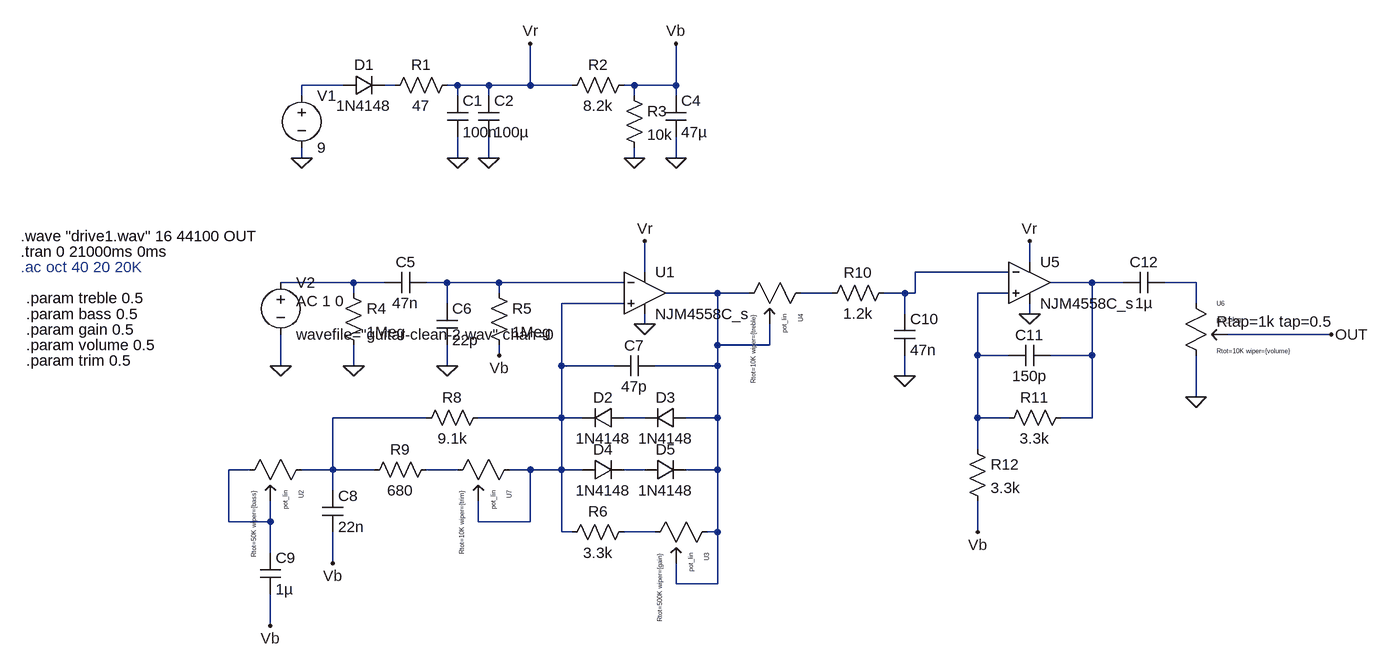
[diagram p0: schematic jan_ray.asc]
jan_ray.asc, the LTspice schematic file:
Version 4
SHEET 1 1744 680
WIRE 96 -432 32 -432
WIRE 176 -432 160 -432
WIRE 272 -432 256 -432
WIRE 320 -432 272 -432
WIRE 384 -432 384 -496
WIRE 384 -432 320 -432
WIRE 448 -432 384 -432
WIRE 544 -432 528 -432
WIRE 608 -432 608 -496
WIRE 608 -432 544 -432
WIRE 32 -416 32 -432
WIRE 272 -416 272 -432
WIRE 320 -416 320 -432
WIRE 544 -416 544 -432
WIRE 608 -416 608 -432
WIRE 32 -320 32 -336
WIRE 272 -320 272 -352
WIRE 320 -320 320 -352
WIRE 544 -320 544 -336
WIRE 608 -320 608 -352
WIRE 1152 -160 1152 -192
WIRE 560 -144 560 -192
WIRE 1120 -144 976 -144
WIRE 112 -128 0 -128
WIRE 160 -128 112 -128
WIRE 256 -128 224 -128
WIRE 336 -128 256 -128
WIRE 528 -128 336 -128
WIRE 1248 -128 1184 -128
WIRE 1296 -128 1248 -128
WIRE 1408 -128 1360 -128
WIRE 112 -112 112 -128
WIRE 336 -112 336 -128
WIRE 672 -112 592 -112
WIRE 720 -112 672 -112
WIRE 848 -112 800 -112
WIRE 960 -112 928 -112
WIRE 976 -112 976 -144
WIRE 976 -112 960 -112
WIRE 1120 -112 1072 -112
WIRE 256 -96 256 -128
WIRE 528 -96 432 -96
WIRE 1408 -96 1408 -128
WIRE 960 -80 960 -112
WIRE 1152 -80 1152 -96
WIRE 560 -64 560 -80
WIRE 1616 -48 1456 -48
WIRE 672 -32 672 -112
WIRE 752 -32 752 -64
WIRE 752 -32 672 -32
WIRE 336 -16 336 -32
WIRE 1072 -16 1072 -112
WIRE 1120 -16 1072 -16
WIRE 1248 -16 1248 -128
WIRE 1248 -16 1184 -16
WIRE 0 0 0 -48
WIRE 112 0 112 -32
WIRE 256 0 256 -32
WIRE 432 0 432 -96
WIRE 512 0 432 0
WIRE 672 0 672 -32
WIRE 672 0 576 0
WIRE 960 16 960 -16
WIRE 1408 48 1408 -16
WIRE 224 80 80 80
WIRE 432 80 432 0
WIRE 432 80 304 80
WIRE 464 80 432 80
WIRE 560 80 528 80
WIRE 672 80 672 0
WIRE 672 80 624 80
WIRE 1072 80 1072 -16
WIRE 1120 80 1072 80
WIRE 1248 80 1248 -16
WIRE 1248 80 1200 80
WIRE 1072 128 1072 80
WIRE -48 160 -80 160
WIRE 80 160 80 80
WIRE 80 160 32 160
WIRE 144 160 80 160
WIRE 272 160 224 160
WIRE 384 160 352 160
WIRE 432 160 432 80
WIRE 432 160 384 160
WIRE 464 160 432 160
WIRE 560 160 528 160
WIRE 672 160 672 80
WIRE 672 160 624 160
WIRE 80 192 80 160
WIRE -80 240 -80 160
WIRE -16 240 -16 208
WIRE -16 240 -80 240
WIRE 304 240 304 208
WIRE 384 240 384 160
WIRE 384 240 304 240
WIRE 432 256 432 160
WIRE 448 256 432 256
WIRE 576 256 528 256
WIRE 672 256 672 160
WIRE 672 256 656 256
WIRE 1072 256 1072 208
WIRE -16 288 -16 240
WIRE 80 304 80 256
WIRE 608 336 608 304
WIRE 672 336 672 256
WIRE 672 336 608 336
WIRE -16 400 -16 352
FLAG 272 -320 0
FLAG 320 -320 0
FLAG 544 -320 0
FLAG 608 -320 0
FLAG 32 -320 0
FLAG 384 -496 Vr
FLAG 608 -496 Vb
FLAG 112 0 0
FLAG 256 0 0
FLAG 336 -16 Vb
FLAG 0 0 0
FLAG 560 -64 0
FLAG 560 -192 Vr
FLAG 80 304 Vb
FLAG -16 400 Vb
FLAG 960 16 0
FLAG 1408 48 0
FLAG 1152 -80 0
FLAG 1152 -192 Vr
FLAG 1072 256 Vb
FLAG 1616 -48 OUT
SYMBOL diode 96 -448 M90
WINDOW 0 0 32 VBottom 2
WINDOW 3 32 32 VTop 2
SYMATTR InstName D1
SYMATTR Value 1N4148
SYMBOL res 272 -448 R90
WINDOW 0 0 56 VBottom 2
WINDOW 3 32 56 VTop 2
SYMATTR InstName R1
SYMATTR Value 47
SYMBOL cap 256 -416 R0
SYMATTR InstName C1
SYMATTR Value 100n
SYMBOL cap 304 -416 R0
SYMATTR InstName C2
SYMATTR Value 100µ
SYMBOL res 544 -448 R90
WINDOW 0 0 56 VBottom 2
WINDOW 3 32 56 VTop 2
SYMATTR InstName R2
SYMATTR Value 8.2k
SYMBOL res 528 -432 R0
SYMATTR InstName R3
SYMATTR Value 10k
SYMBOL cap 592 -416 R0
SYMATTR InstName C4
SYMATTR Value 47µ
SYMBOL voltage 32 -432 R0
WINDOW 123 0 0 Left 2
WINDOW 39 0 0 Left 2
SYMATTR InstName V1
SYMATTR Value 9
SYMBOL res 96 -128 R0
SYMATTR InstName R4
SYMATTR Value 1Meg
SYMBOL cap 224 -144 R90
WINDOW 0 0 32 VBottom 2
WINDOW 3 32 32 VTop 2
SYMATTR InstName C5
SYMATTR Value 47n
SYMBOL cap 240 -96 R0
SYMATTR InstName C6
SYMATTR Value 22p
SYMBOL res 320 -128 R0
SYMATTR InstName R5
SYMATTR Value 1Meg
SYMBOL cap 576 -16 R90
WINDOW 0 0 32 VBottom 2
WINDOW 3 32 32 VTop 2
SYMATTR InstName C7
SYMATTR Value 47p
SYMBOL diode 528 64 R90
WINDOW 0 0 32 VBottom 2
WINDOW 3 32 32 VTop 2
SYMATTR InstName D2
SYMATTR Value 1N4148
SYMBOL diode 624 64 R90
WINDOW 0 0 32 VBottom 2
WINDOW 3 32 32 VTop 2
SYMATTR InstName D3
SYMATTR Value 1N4148
SYMBOL diode 464 176 R270
WINDOW 0 32 32 VTop 2
WINDOW 3 0 32 VBottom 2
SYMATTR InstName D4
SYMATTR Value 1N4148
SYMBOL diode 560 176 R270
WINDOW 0 32 32 VTop 2
WINDOW 3 0 32 VBottom 2
SYMATTR InstName D5
SYMATTR Value 1N4148
SYMBOL voltage 0 -144 R0
WINDOW 123 24 44 Left 2
WINDOW 39 0 0 Left 2
SYMATTR Value2 AC 1 0
SYMATTR InstName V2
SYMATTR Value wavefile="guitar-clean-2.wav" chan=0
SYMBOL res 320 64 R90
WINDOW 0 0 56 VBottom 2
WINDOW 3 32 56 VTop 2
SYMATTR InstName R8
SYMATTR Value 9.1k
SYMBOL res 240 144 R90
WINDOW 0 0 56 VBottom 2
WINDOW 3 32 56 VTop 2
SYMATTR InstName R9
SYMATTR Value 680
SYMBOL cap 64 192 R0
SYMATTR InstName C8
SYMATTR Value 22n
SYMBOL potentiometer_standard 48 144 R90
SYMATTR InstName U2
SYMATTR Value Rtot=50K wiper={bass}
SYMATTR SpiceLine ""
SYMBOL cap -32 288 R0
SYMATTR InstName C9
SYMATTR Value 1µ
SYMBOL potentiometer_standard 672 240 R90
SYMATTR InstName U3
SYMATTR Value Rtot=500K wiper={gain}
SYMATTR SpiceLine ""
SYMBOL res 544 240 R90
WINDOW 0 0 56 VBottom 2
WINDOW 3 32 56 VTop 2
SYMATTR InstName R6
SYMATTR Value 3.3k
SYMBOL potentiometer_standard 816 -128 R90
SYMATTR InstName U4
SYMATTR Value Rtot=10K wiper={treble}
SYMATTR SpiceLine ""
SYMBOL res 944 -128 R90
WINDOW 0 0 56 VBottom 2
WINDOW 3 32 56 VTop 2
SYMATTR InstName R10
SYMATTR Value 1.2k
SYMBOL cap 944 -80 R0
SYMATTR InstName C10
SYMATTR Value 47n
SYMBOL cap 1184 -32 R90
WINDOW 0 0 32 VBottom 2
WINDOW 3 32 32 VTop 2
SYMATTR InstName C11
SYMATTR Value 150p
SYMBOL res 1216 64 R90
WINDOW 0 0 56 VBottom 2
WINDOW 3 32 56 VTop 2
SYMATTR InstName R11
SYMATTR Value 3.3k
SYMBOL res 1056 112 R0
SYMATTR InstName R12
SYMATTR Value 3.3k
SYMBOL cap 1360 -144 R90
WINDOW 0 0 32 VBottom 2
WINDOW 3 32 32 VTop 2
SYMATTR InstName C12
SYMATTR Value 1µ
SYMBOL potentiometer_standard 1392 -112 R0
WINDOW 39 48 44 Left 2
SYMATTR InstName U6
SYMATTR Value Rtot=10K wiper={volume}
SYMATTR SpiceModel pot_plog
SYMBOL Opamps\\NJM4558 560 -176 R0
SYMATTR InstName U1
SYMATTR Value NJM4558C_s
SYMBOL Opamps\\NJM4558 1152 -192 R0
SYMATTR InstName U5
SYMATTR Value NJM4558C_s
SYMBOL potentiometer_standard 368 144 R90
SYMATTR InstName U7
SYMATTR Value Rtot=10K wiper={trim}
SYMATTR SpiceLine ""
TEXT -400 -176 Left 2 !.tran 0 21000ms 0ms
TEXT -392 -80 Left 2 !.param bass 0.5
TEXT -392 -56 Left 2 !.param gain 0.5
TEXT -392 -104 Left 2 !.param treble 0.5
TEXT -392 -32 Left 2 !.param volume 0.5
TEXT -400 -152 Left 2 ;.ac oct 40 20 20K
TEXT -392 -8 Left 2 !.param trim 0.5
TEXT -400 -200 Left 2 !.wave "drive1.wav" 16 44100 OUT

The netlist it stands for:
* jan_ray.asc
D1 N001 N002 1N4148
R1 Vr N002 47
C1 Vr 0 100n
C2 Vr 0 100µ
R2 Vb Vr 8.2k
R3 Vb 0 10k
C4 Vb 0 47µ
V1 N001 0 9
R4 N004 0 1Meg
C5 N005 N004 47n
C6 N005 0 22p
R5 N005 Vb 1Meg
C7 N008 N011 47p
D2 N013 N011 1N4148
D3 N008 N013 1N4148
D4 N011 N016 1N4148
D5 N016 N008 1N4148
V2 N004 0 wavefile="guitar-clean-2.wav" chan=0 AC 1 0
R8 N011 N012 9.1k
R9 N015 N012 680
C8 N012 Vb 22n
XU2 N012 N014 N014 pot_lin Rtot=50K wiper={bass}  ; pins A B C
C9 N014 Vb 1µ
XU3 N008 N017 N008 pot_lin Rtot=500K wiper={gain}  ; pins A B C
R6 N017 N011 3.3k
XU4 N009 N008 N008 pot_lin Rtot=10K wiper={treble}  ; pins A B C
R10 N003 N009 1.2k
C10 N003 0 47n
C11 N006 N010 150p
R11 N006 N010 3.3k
R12 N010 Vb 3.3k
C12 N007 N006 1µ
XU6 N007 0 OUT pot_plog Rtot=10K wiper={volume} Rtap=1k tap=0.5  ; pins A B C
XU1 N011 N005 Vr 0 N008 NJM4558C_s  ; pins In+ In- V+ V- OUT
XU5 N010 N003 Vr 0 N006 NJM4558C_s  ; pins In+ In- V+ V- OUT
XU7 N011 N015 N011 pot_lin Rtot=10K wiper={trim}  ; pins A B C
.model D D
.lib standard.dio
.tran 0 21000ms 0ms
.param bass 0.5
.param gain 0.5
.param treble 0.5
.param volume 0.5
* .ac oct 40 20 20K
.param trim 0.5
.wave "drive1.wav" 16 44100 OUT
.backanno
.end